# Altium schematic sheet PCB_CHECKV3.2-20201218.SchDoc
size A3
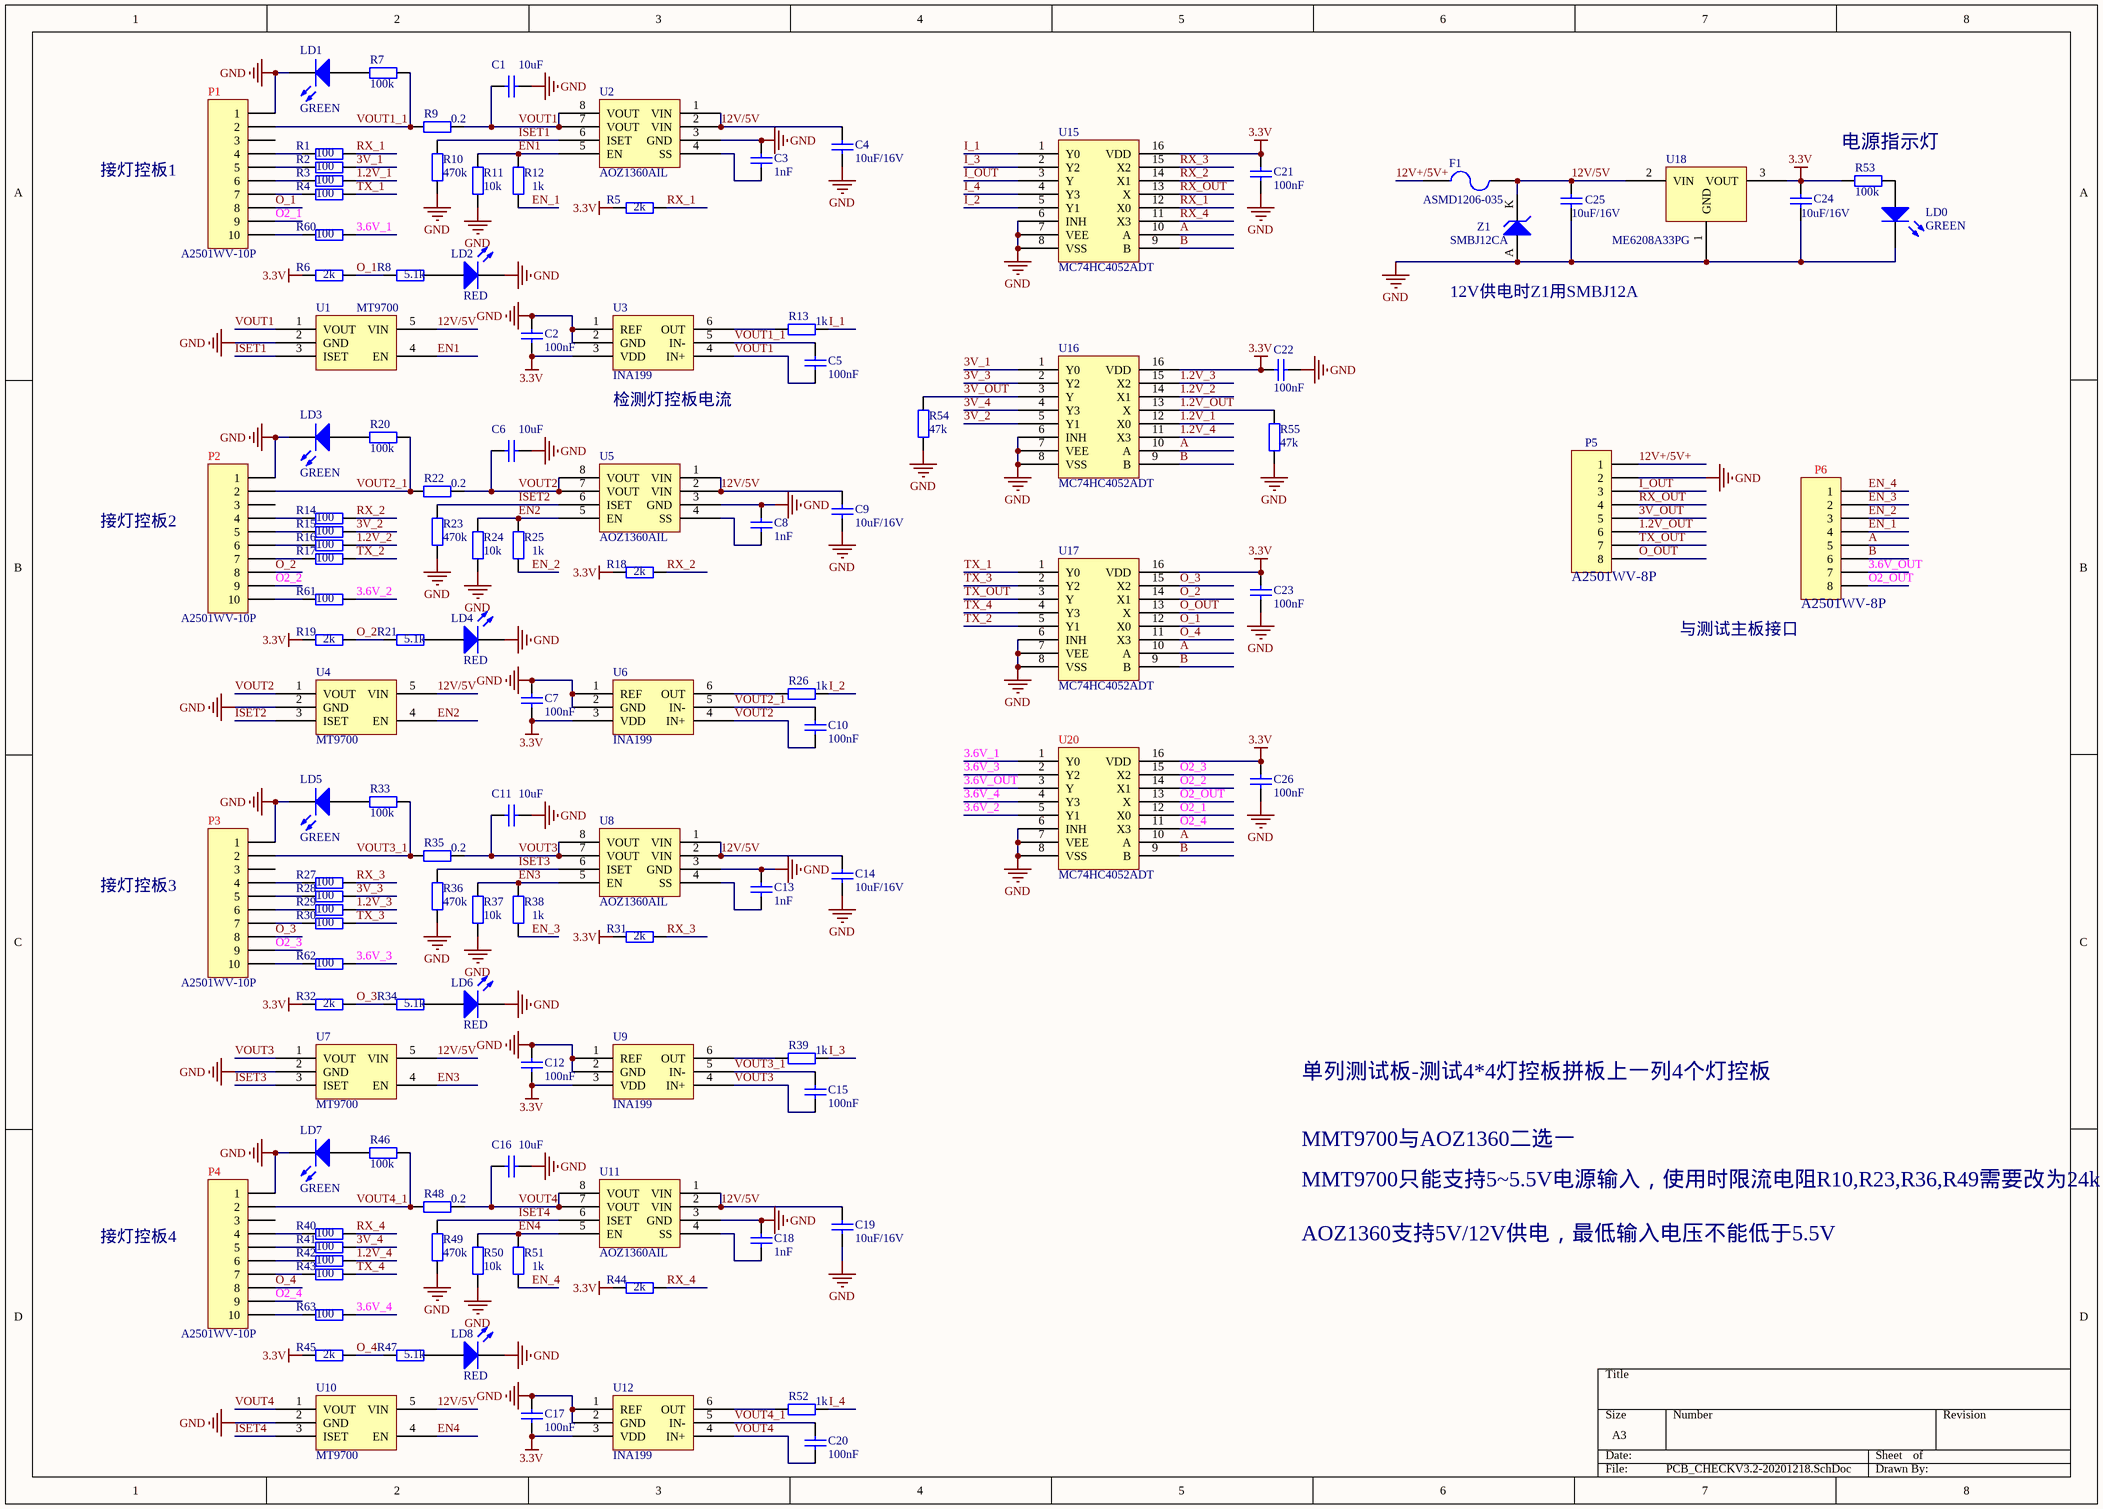
[diagram p0: PCB_CHECKV3.2-20201218.SchDoc]

## Parts
C1  10uF  [C0603]
C2  100nF  [C0603]
C3  1nF  [C0603]
C4  10uF/16V  [C0603]
C5  100nF  [C0603]
C6  10uF  [C0603]
C7  100nF  [C0603]
C8  1nF  [C0603]
C9  10uF/16V  [C0603]
C10  100nF  [C0603]
C11  10uF  [C0603]
C12  100nF  [C0603]
C13  1nF  [C0603]
C14  10uF/16V  [C0603]
C15  100nF  [C0603]
C16  10uF  [C0603]
C17  100nF  [C0603]
C18  1nF  [C0603]
C19  10uF/16V  [C0603]
C20  100nF  [C0603]
C21  100nF  [C0603]
C22  100nF  [C0603]
C23  100nF  [C0603]
C24  10uF/16V  [C0603]
C25  10uF/16V  [C0603]
C26  100nF  [C0603]
F1  ASMD1206-035  [R1206]
LD0  GREEN  [LED-0603]
LD1  GREEN  [LED-0603]
LD2  RED  [LED-0603]
LD3  GREEN  [LED-0603]
LD4  RED  [LED-0603]
LD5  GREEN  [LED-0603]
LD6  RED  [LED-0603]
LD7  GREEN  [LED-0603]
LD8  RED  [LED-0603]
P1  A2501WV-10P  [XH2.5-8P]
P2  A2501WV-10P  [XH2.5-8P]
P3  A2501WV-10P  [XH2.5-8P]
P4  A2501WV-10P  [XH2.5-8P]
P5  A2501WV-8P  [XH2.5-8P]
P6  A2501WV-8P  [XH2.5-8P]
R1  100  [R0603]
R2  100  [R0603]
R3  100  [R0603]
R4  100  [R0603]
R5  2k  [R0603]
R6  2k  [R0603]
R7  100k  [R0603]
R8  5.1k  [R0603]
R9  0.2  [R0603]
R10  470k  [R0603]
R11  10k  [R0603]
R12  1k  [R0603]
R13  1k  [R0603]
R14  100  [R0603]
R15  100  [R0603]
R16  100  [R0603]
R17  100  [R0603]
R18  2k  [R0603]
R19  2k  [R0603]
R20  100k  [R0603]
R21  5.1k  [R0603]
R22  0.2  [R0603]
R23  470k  [R0603]
R24  10k  [R0603]
R25  1k  [R0603]
R26  1k  [R0603]
R27  100  [R0603]
R28  100  [R0603]
R29  100  [R0603]
R30  100  [R0603]
R31  2k  [R0603]
R32  2k  [R0603]
R33  100k  [R0603]
R34  5.1k  [R0603]
R35  0.2  [R0603]
R36  470k  [R0603]
R37  10k  [R0603]
R38  1k  [R0603]
R39  1k  [R0603]
R40  100  [R0603]
R41  100  [R0603]
R42  100  [R0603]
R43  100  [R0603]
R44  2k  [R0603]
R45  2k  [R0603]
R46  100k  [R0603]
R47  5.1k  [R0603]
R48  0.2  [R0603]
R49  470k  [R0603]
R50  10k  [R0603]
R51  1k  [R0603]
R52  1k  [R0603]
R53  100k  [R0603]
R54  47k  [R0603]
R55  47k  [R0603]
R60  100  [R0603]
R61  100  [R0603]
R62  100  [R0603]
R63  100  [R0603]
U1  MT9700  [SOT23-5]
U2  AOZ1360AIL  [SO-8S]
U3  INA199  [SC70-6]
U4  MT9700  [SOT23-5]
U5  AOZ1360AIL  [SO-8S]
U6  INA199  [SC70-6]
U7  MT9700  [SOT23-5]
U8  AOZ1360AIL  [SO-8S]
U9  INA199  [SC70-6]
U10  MT9700  [SOT23-5]
U11  AOZ1360AIL  [SO-8S]
U12  INA199  [SC70-6]
U15  MC74HC4052ADT  [TSSOP16_N]
U16  MC74HC4052ADT  [TSSOP16_N]
U17  MC74HC4052ADT  [TSSOP16_N]
U18  ME6208A33PG  [SOT89N]
U20  MC74HC4052ADT  [TSSOP16_N]
Z1  SMBJ12CA  [SMB]

## Nets
3.3V: C2.1 C7.1 C12.1 C17.1 C21.2 C22.2 C23.2 C24.1 C26.2 R5.1 R6.1 R18.1 R19.1 R31.1 R32.1 R44.1 R45.1 R53.1 U3.3(VDD) U6.3(VDD) U9.3(VDD) U12.3(VDD) U15.16(VDD) U16.16(VDD) U17.16(VDD) U18.3(VOUT) U20.16(VDD)
GND: C1.2 C2.2 C3.2 C4.2 C6.2 C7.2 C8.2 C9.2 C11.2 C12.2 C13.2 C14.2 C16.2 C17.2 C18.2 C19.2 C21.1 C22.1 C23.1 C24.2 C25.2 C26.1 LD0.2(K) LD1.2(K) LD2.2(K) LD3.2(K) LD4.2(K) LD5.2(K) LD6.2(K) LD7.2(K) LD8.2(K) P1.1 P2.1 P3.1 P4.1 P5.2 R10.2 R11.2 R23.2 R24.2 R36.2 R37.2 R49.2 R50.2 R54.2 R55.2 U1.2(GND) U2.3(GND) U3.1(REF) U3.2(GND) U4.2(GND) U5.3(GND) U6.1(REF) U6.2(GND) U7.2(GND) U8.3(GND) U9.1(REF) U9.2(GND) U10.2(GND) U11.3(GND) U12.1(REF) U12.2(GND) U15.6(INH) U15.7(VEE) U15.8(VSS) U16.6(INH) U16.7(VEE) U16.8(VSS) U17.6(INH) U17.7(VEE) U17.8(VSS) U18.1(GND) U20.6(INH) U20.7(VEE) U20.8(VSS) Z1.A
1.2V_1: R3.2 U16.12(X0)
1.2V_2: R16.2 U16.14(X1)
1.2V_3: R29.2 U16.15(X2)
1.2V_4: R42.2 U16.11(X3)
1.2V_OUT: P5.6 R55.1 U16.13(X)
3.6V_1: R60.2 U20.1(Y0)
3.6V_2: R61.2 U20.5(Y1)
3.6V_3: R62.2 U20.2(Y2)
3.6V_4: R63.2 U20.4(Y3)
3.6V_OUT: P6.7 U20.3(Y)
3V_1: R2.2 U16.1(Y0)
3V_2: R15.2 U16.5(Y1)
3V_3: R28.2 U16.2(Y2)
3V_4: R41.2 U16.4(Y3)
3V_OUT: P5.5 R54.1 U16.3(Y)
12V+/5V+: F1.1 P5.1
12V/5V: C4.1 C9.1 C14.1 C19.1 C25.1 F1.2 U1.5(VIN) U2.1(VIN) U2.2(VIN) U4.5(VIN) U5.1(VIN) U5.2(VIN) U7.5(VIN) U8.1(VIN) U8.2(VIN) U10.5(VIN) U11.1(VIN) U11.2(VIN) U18.2(VIN) Z1.K
A: P6.5 U15.10(A) U16.10(A) U17.10(A) U20.10(A)
B: P6.6 U15.9(B) U16.9(B) U17.9(B) U20.9(B)
EN1: R11.1 R12.1 U1.4(EN) U2.5(EN)
EN2: R24.1 R25.1 U4.4(EN) U5.5(EN)
EN3: R37.1 R38.1 U7.4(EN) U8.5(EN)
EN4: R50.1 R51.1 U10.4(EN) U11.5(EN)
EN_1: P6.4 R12.2
EN_2: P6.3 R25.2
EN_3: P6.2 R38.2
EN_4: P6.1 R51.2
I_1: R13.2 U15.1(Y0)
I_2: R26.2 U15.5(Y1)
I_3: R39.2 U15.2(Y2)
I_4: R52.2 U15.4(Y3)
I_OUT: P5.3 U15.3(Y)
ISET1: R10.1 U1.3(ISET) U2.6(ISET)
ISET2: R23.1 U4.3(ISET) U5.6(ISET)
ISET3: R36.1 U7.3(ISET) U8.6(ISET)
ISET4: R49.1 U10.3(ISET) U11.6(ISET)
O2_1: P1.9 U20.12(X0)
O2_2: P2.9 U20.14(X1)
O2_3: P3.9 U20.15(X2)
O2_4: P4.9 U20.11(X3)
O2_OUT: P6.8 U20.13(X)
O_1: P1.8 R6.2 R8.1 U17.12(X0)
O_2: P2.8 R19.2 R21.1 U17.14(X1)
O_3: P3.8 R32.2 R34.1 U17.15(X2)
O_4: P4.8 R45.2 R47.1 U17.11(X3)
O_OUT: P5.8 U17.13(X)
RX_1: R1.2 R5.2 U15.12(X0)
RX_2: R14.2 R18.2 U15.14(X1)
RX_3: R27.2 R31.2 U15.15(X2)
RX_4: R40.2 R44.2 U15.11(X3)
RX_OUT: P5.4 U15.13(X)
TX_1: R4.2 U17.1(Y0)
TX_2: R17.2 U17.5(Y1)
TX_3: R30.2 U17.2(Y2)
TX_4: R43.2 U17.4(Y3)
TX_OUT: P5.7 U17.3(Y)
VOUT1: C1.1 C5.1 R9.2 U1.1(VOUT) U2.7(VOUT) U2.8(VOUT) U3.4(IN+)
VOUT1_1: C5.2 P1.2 R7.1 R9.1 U3.5(IN-)
VOUT2: C6.1 C10.1 R22.2 U4.1(VOUT) U5.7(VOUT) U5.8(VOUT) U6.4(IN+)
VOUT2_1: C10.2 P2.2 R20.1 R22.1 U6.5(IN-)
VOUT3: C11.1 C15.1 R35.2 U7.1(VOUT) U8.7(VOUT) U8.8(VOUT) U9.4(IN+)
VOUT3_1: C15.2 P3.2 R33.1 R35.1 U9.5(IN-)
VOUT4: C16.1 C20.1 R48.2 U10.1(VOUT) U11.7(VOUT) U11.8(VOUT) U12.4(IN+)
VOUT4_1: C20.2 P4.2 R46.1 R48.1 U12.5(IN-)
NetC3_1: C3.1 U2.4(SS)
NetC8_1: C8.1 U5.4(SS)
NetC13_1: C13.1 U8.4(SS)
NetC18_1: C18.1 U11.4(SS)
NetLD0_1: LD0.1(A) R53.2
NetLD1_1: LD1.1(A) R7.2
NetLD2_1: LD2.1(A) R8.2
NetLD3_1: LD3.1(A) R20.2
NetLD4_1: LD4.1(A) R21.2
NetLD5_1: LD5.1(A) R33.2
NetLD6_1: LD6.1(A) R34.2
NetLD7_1: LD7.1(A) R46.2
NetLD8_1: LD8.1(A) R47.2
NetP1_4: P1.4 R1.1
NetP1_5: P1.5 R2.1
NetP1_6: P1.6 R3.1
NetP1_7: P1.7 R4.1
NetP1_10: P1.10 R60.1
NetP2_4: P2.4 R14.1
NetP2_5: P2.5 R15.1
NetP2_6: P2.6 R16.1
NetP2_7: P2.7 R17.1
NetP2_10: P2.10 R61.1
NetP3_4: P3.4 R27.1
NetP3_5: P3.5 R28.1
NetP3_6: P3.6 R29.1
NetP3_7: P3.7 R30.1
NetP3_10: P3.10 R62.1
NetP4_4: P4.4 R40.1
NetP4_5: P4.5 R41.1
NetP4_6: P4.6 R42.1
NetP4_7: P4.7 R43.1
NetP4_10: P4.10 R63.1
NetR13_1: R13.1 U3.6(OUT)
NetR26_1: R26.1 U6.6(OUT)
NetR39_1: R39.1 U9.6(OUT)
NetR52_1: R52.1 U12.6(OUT)

Not connected (* = marked no-connect by the designer): P1 3; P2 3; P3 3; P4 3

## Notes on the sheet
- 接灯控板1
- (near R53) 电源指示灯
- 12V供电时Z1用SMBJ12A
- (near U3) 检测灯控板电流
- 接灯控板2
- 与测试主板接口
- 接灯控板3
- 单列测试板-测试4*4灯控板拼板上一列4个灯控板
- MMT9700与AOZ1360二选一
- MMT9700只能支持5~5.5V电源输入，使用时限流电阻R10,R23,R36,R49需要改为24k
- 接灯控板4
- AOZ1360支持5V/12V供电，最低输入电压不能低于5.5V

## Library data of the parts
C1-C26 = Cap: Capacitor; Published: 8-Jun-2000; LatestRevisionDate: 17-Jul-2002; LatestRevisionNote: Re-released for DXP Platform.; PackageReference: RAD-0.3; Publisher: Altium Limited; PackageDescription: Radial Cap, Thru-Hole; 2 Leads; 0.3 in Pin Spacing
  C1 C6 C11 C16: Value: 10uF
  C2 C5 C7 C10 C12 C15 C17 C20-C23 C26: Value: 100nF
  C3 C8 C13 C18: Value: 1nF
  C4 C9 C14 C19 C24 C25: Value: 10uF/16V
F1 = Fuse 2: Fuse; Published: 8-Jun-2000; LatestRevisionDate: 17-Jul-2002; LatestRevisionNote: Re-released for DXP Platform.; PackageReference: PIN-W2/E2.8; Publisher: Altium Limited; PackageDescription: Thru-Hole; 2 Leads
LD0-LD8 = LED0: LED灯; Published: 8-Jun-2000; LatestRevisionDate: 08-Jul-2005; LatestRevisionNote: Mech Layer 1 removed.; PackageReference: LED-0; Publisher: Altium Limited
  LD0 LD1 LD3 LD5 LD7: Value: GREEN
  LD2 LD4 LD6 LD8: Value: RED
P1-P4 = Header 10: Header, 8-Pin; LatestRevisionDate: 17-Jul-2002; LatestRevisionNote: Re-released for DXP Platform.; Publisher: Altium Limited
P5 P6 = Header 8: Header, 8-Pin; LatestRevisionDate: 17-Jul-2002; LatestRevisionNote: Re-released for DXP Platform.; Publisher: Altium Limited
R1-R55 R60-R63 = Res2: Resistor; Published: 8-Jun-2000; LatestRevisionDate: 17-Jul-2002; LatestRevisionNote: Re-released for DXP Platform.; PackageReference: AXIAL-0.4; Publisher: Altium Limited; PackageDescription: Axial Device, Thru-Hole; 2 Leads; 0.4 in Pin Spacing
  R1-R4 R14-R17 R27-R30 R40-R43 R60-R63: Value: 100
  R5 R6 R18 R19 R31 R32 R44 R45: Value: 2k
  R7 R20 R33 R46 R53: Value: 100k
  R8 R21 R34 R47: Value: 5.1k
  R9 R22 R35 R48: Value: 0.2
  R10 R23 R36 R49: Value: 470k
  R11 R24 R37 R50: Value: 10k
  R12 R13 R25 R26 R38 R39 R51 R52: Value: 1k
  R54 R55: Value: 47k
U15-U17 U20 = CD4052
U18 = ME6208A50PG
Z1 = D Zener: Zener Diode; Published: 8-Jun-2000; LatestRevisionDate: 17-Jul-2002; LatestRevisionNote: Re-released for DXP Platform.; PackageReference: DIODE-0.7; Publisher: Altium Limited; PackageDescription: Diode, Thru-Hole; 2 Leads; 0.7 in Pin Spacing